# Altium schematic sheet range_valid_stretching.SchDoc: Range Valid Signal Stretching
size A4; DrawnBy: Stefan Lippuner; Organization: TIK; DocumentNumber: 8; Revision: 2; SheetNumber: 8; SheetTotal: 8
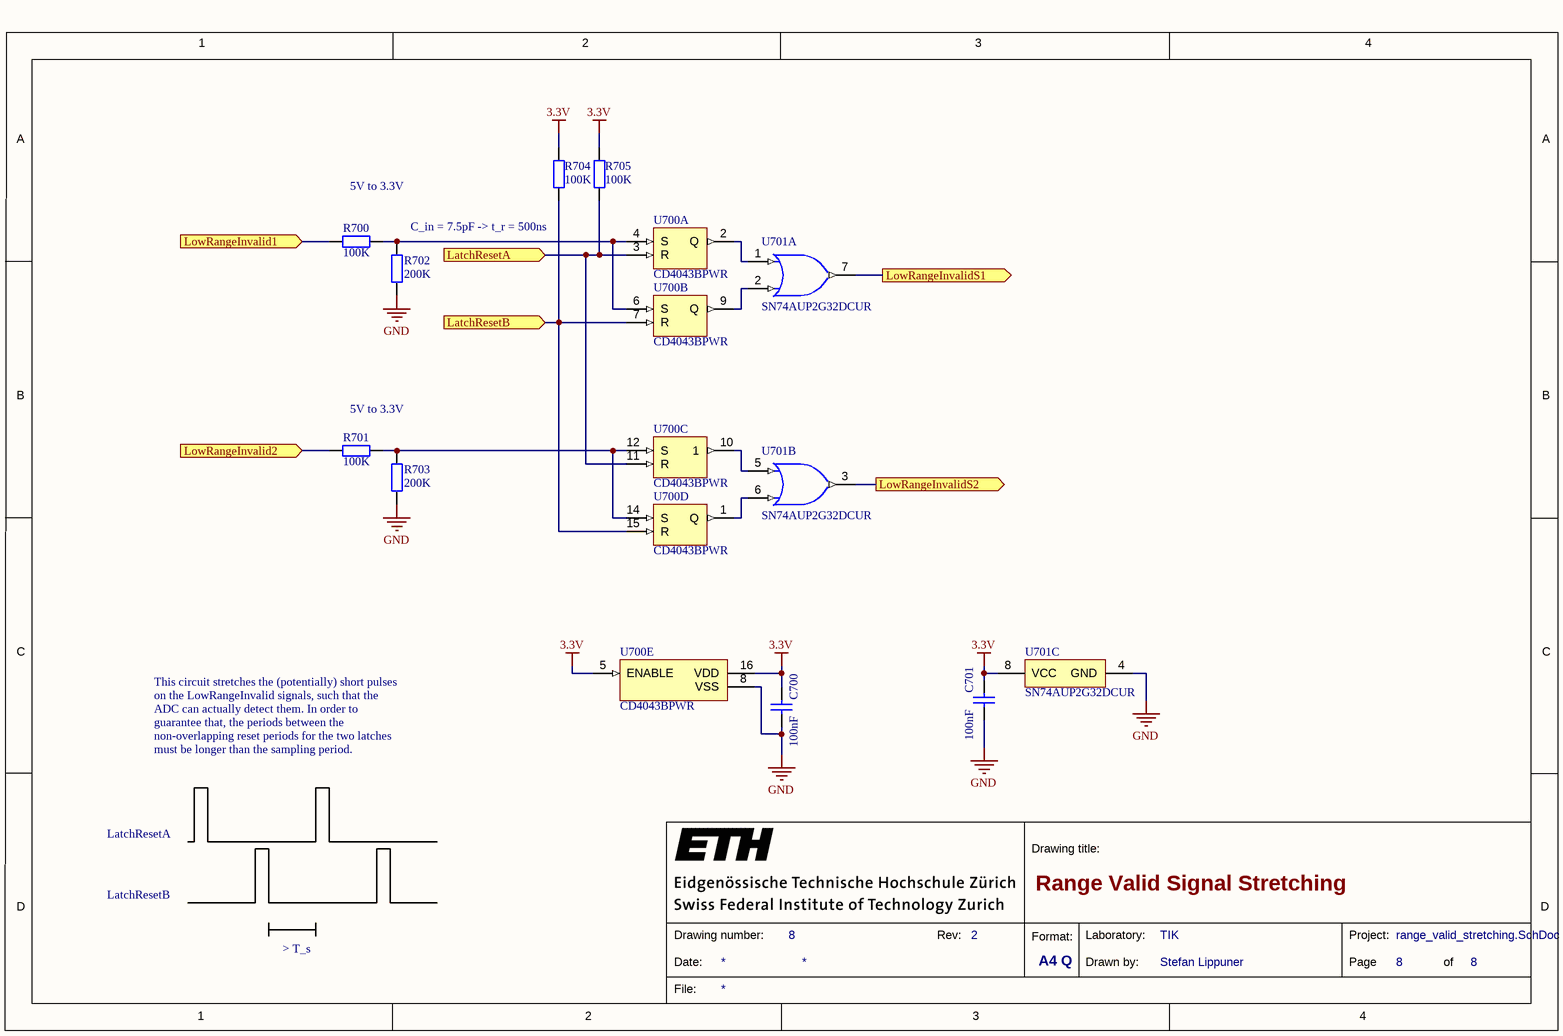
[diagram p0: range_valid_stretching.SchDoc]

## Parts
C700  100nF  [CAPC0402(1005)60_L]
C701  100nF  [CAPC0402(1005)60_L]
R700  100K  [RESC0402(1005)_L]
R701  100K  [RESC0402(1005)_L]
R702  200K  [RESC0402(1005)_L]
R703  200K  [RESC0402(1005)_L]
R704  100K  [RESC0402(1005)_L]
R705  100K  [RESC0402(1005)_L]
U700  CD4043BPWR  [TSSOP-16_L]  (parts A,B,C,D,E of 5)
U701  SN74AUP2G32DCUR  [DCU0008A_L]  (parts A,B,C of 3)

## Ports
LatchResetA (in), LatchResetB (in), LowRangeInvalid1 (in), LowRangeInvalid2 (in), LowRangeInvalidS1 (out), LowRangeInvalidS2 (out)

## Nets
3.3V: C700.2 C701.2 R704.2 R705.2 U700.5(ENABLE) U700.16(VDD) U701.8(VCC)
GND: C700.1 C701.1 R702.1 R703.1 U700.8(VSS) U701.4(GND)
LatchResetA: R705.1 U700.3(R) U700.11(R) ; port LatchResetA
LatchResetB: R704.1 U700.7(R) U700.15(R) ; port LatchResetB
LowRangeInvalid1: R700.1 ; port LowRangeInvalid1
LowRangeInvalid2: R701.1 ; port LowRangeInvalid2
LowRangeInvalidS1: U701.7(1Y) ; port LowRangeInvalidS1
LowRangeInvalidS2: U701.3(2Y) ; port LowRangeInvalidS2
NetR700_2: R700.2 R702.2 U700.4(S) U700.6(S)
NetR701_2: R701.2 R703.2 U700.12(S) U700.14(S)
NetU700_1: U700.1(Q) U701.6(2B)
NetU700_2: U700.2(Q) U701.1(1A)
NetU700_9: U700.9(Q) U701.2(1B)
NetU700_10: U700.10(1) U701.5(2A)

## Notes on the sheet
- 5V to 3.3V
- C_in = 7.5pF -> t_r = 500ns
- This circuit stretches the (potentially) short pulses on the LowRangeInvalid signals, such that the ADC can actually detect them. In order to guarantee that, the periods between the non-overlapping reset periods for the two latches must be longer than the sampling period.
- LatchResetA
- LatchResetB
- > T_s
- 1
- 2
- 3
- 4
- A
- B
- C
- Drawing title:
- D
- Date:
- Drawing number:
- Rev:
- Format:
- A4 Q
- Drawn by:
- Laboratory:
- Page
- Project:
- of
- File:

## Library data of the parts
C700 C701 = CMP-1034-02071-1: CAP 100nF 16V -20% to +80% 0402 (1005 Metric) Thickness 0.6mm SMD; Case-Metric: 1005; Case-EIA: 0402; Value: 100nF; Rated Voltage: 16 V; Tolerance: -20% to +80%; Technology: SMT; Max Thickness: 0.6 mm
R700 R701 R704 R705 = CMP-1011-00736-1: 100K 0.063W 1% 0402 (1005 Metric)  SMD; Value: 100000.00 Ohm; Case-EIA: 0402; Case-Metric: 1005; Power: 0.063 W; Technology: SMT; Tolerance: 1 %
R702 R703 = CMP-1011-00129-1: 200K 0.063W 5% 0402 (1005 Metric)  SMD; Case-Metric: 1005; Value: 200000.00 Ohm; Case-EIA: 0402; Tolerance: 5 %; Technology: SMT; Power: 0.063 W
U700 = CMP-00223-2: IC NOR R/S LTCH 3ST QUAD 16TSSOP; Manufacturer: Texas Instruments; Logic Type: S-R Latch; Circuit: 1:1; Output Type: Tri-State; Voltage - Supply: 3 V ~ 18 V; Independent Circuits: 4; Delay Time - Propagation: 50ns; Current - Output High, Low: 6.8mA, 6.8mA; Packaging: Tape & Reel (TR); Part Status: Active; Operating Temperature: -55°C ~ 125°C; Mounting Type: Surface Mount; Supplier Device Package: 16-TSSOP; Manufacturer Part Number: CD4043BPWR; Supplier: Digi-Key; Supplier Part Number: 296-14106-2-ND; ComponentLink1Description: cd4043b.pdf; ComponentLink1URL: http://www.ti.com/lit/ds/symlink/cd4043b.pdf; PartId: 1; Package / Case: 16-TSSOP (0.173", 4.40mm Width)
U701 = CMP-0859-00721-3: Low-Power Dual 2-Input Positive-OR Gate, DCU0008A, LARGE T&R; Manufacturer: Texas Instruments; Voltage(Nom)(V): 0.8,1.2,1.5,1.8,2.5,3.3; Output Type: CMOS; Schmitt Trigger: No; ICC @ Nom Voltage(Max)(mA): 0.0009; Technology Family: AUP; Bits(#): 2; Gate Type: OR; VCC(Max)(V): 3.6; Output Drive (IOL/IOH)(Max)(mA): 20/-20; Sub-Family: OR Gate; F @ Nom Voltage(Max)(Mhz): 100; Logic: True; Rating: Catalog; tpd @ Nom Voltage(Max)(ns): 32.8,20.9,14.2,11,7.6,6.2; VCC(Min)(V): 0.8; DatasheetVersion: SCES754B; Operating Temperature Range(C): -40 to 85; Input Type: CMOS; Generic Part Number: SN74AUP2G32; PackageReference: DCU0008A; 3-State Output: No; PartId: 1